# EAGLE design buttons+tft (EAGLE 9.3.1)
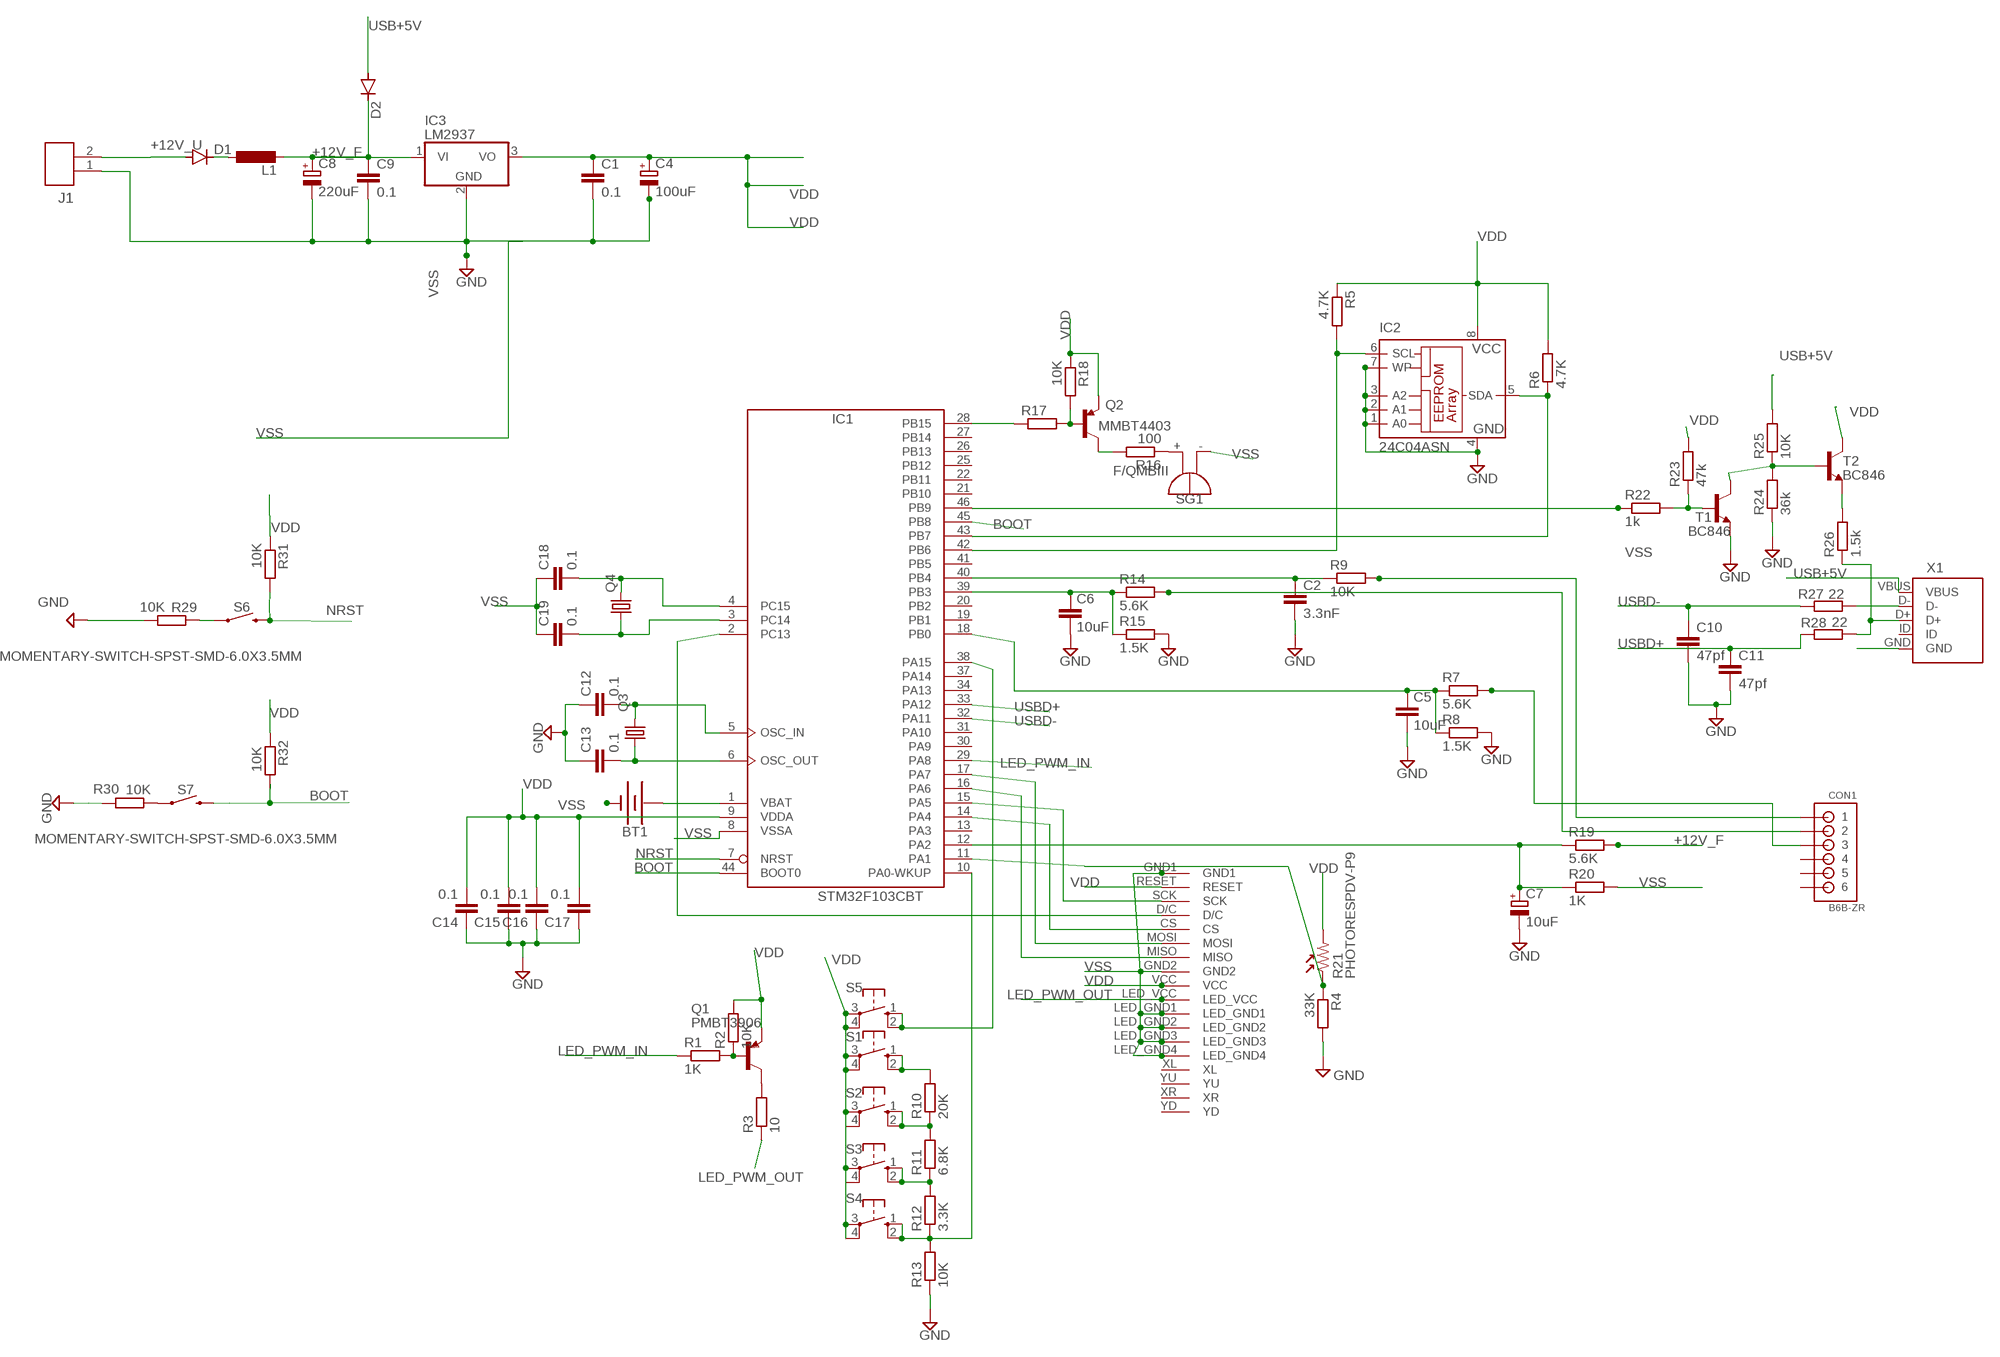
[diagram p0: schematic, sheet 1]

## Parts
BT1  BATTERY  [BATTCOM_20MM_VERTICAL]
C1  0.1  C-EUC0805  [C0805]
C2  3.3nF  C-EUC0805  [C0805]
C4  100uF  CPOL-EUSMCB  [SMC_B]
C5  10uF  C-EUC0805  [C0805]
C6  10uF  C-EUC0805  [C0805]
C7  10uF  CPOL-EUSMCA  [SMC_A]
C8  220uF  CPOL-EUSMCB  [SMC_B]
C9  0.1  C-EUC0805  [C0805]
C10  47pf  C-EUC0805  [C0805]
C11  47pf  C-EUC0805  [C0805]
C12  0.1  C-EUC0805  [C0805]
C13  0.1  C-EUC0805  [C0805]
C14  0.1  C-EUC0805  [C0805]
C15  0.1  C-EUC0805  [C0805]
C16  0.1  C-EUC0805  [C0805]
C17  0.1  C-EUC0805  [C0805]
C18  0.1  C-EUC0805  [C0805]
C19  0.1  C-EUC0805  [C0805]
CON1  B6B-ZR  [B6B-ZR]
D1  DIODE-SOD123  [SOD123]
D2  DIODE-SOD123  [SOD123]
IC1  STM32F103CBT  [LQFP48]
IC2  24C04ASN  [SO-08]
IC3  LM2937  [TO263-3]
J1  JST_ZH_2PIN  [JST_ZH_2PIN]
L1  L_EU-CDRH4D28  [INDUCTOR_CDRH4]
Q1  PMBT3906  MMBT4403LT1SMD  [SOT23-BEC]
Q2  MMBT4403  TRANSISTOR_PNPMMBT4403  [SOT23-3]
Q3  KX-9B  [5.0X3.2_2]
Q4  CRYSTALTC26H  [TC26H]
R1  1K  R-EU_R0805  [R0805]
R2  10K  R-EU_R0805  [R0805]
R3  10  R-EU_R0805  [R0805]
R4  33K  R-EU_R0805  [R0805]
R5  4.7K  R-EU_R0805  [R0805]
R6  4.7K  R-EU_R0805  [R0805]
R7  5.6K  R-EU_R0805  [R0805]
R8  1.5K  R-EU_R0805  [R0805]
R9  10K  R-EU_R0805  [R0805]
R10  20K  R-EU_R0805  [R0805]
R11  6.8K  R-EU_R0805  [R0805]
R12  3.3K  R-EU_R0805  [R0805]
R13  10K  R-EU_R0805  [R0805]
R14  5.6K  R-EU_R0805  [R0805]
R15  1.5K  R-EU_R0805  [R0805]
R16  100  R-EU_R0805  [R0805]
R17  1K  R-EU_R0805  [R0805]
R18  10K  R-EU_R0805  [R0805]
R19  5.6K  R-EU_R0805  [R0805]
R20  1K  R-EU_R0805  [R0805]
R21  PHOTORESPDV-P9  [PDV-P9XXX]
R22  1k  R-EU_R0805  [R0805]
R23  47k  R-EU_R0805  [R0805]
R24  36k  R-EU_R0805  [R0805]
R25  10K  R-EU_R0805  [R0805]
R26  1.5k  R-EU_R0805  [R0805]
R27  22  R-EU_R0805  [R0805]
R28  22  R-EU_R0805  [R0805]
R29  10K  R-EU_R0805  [R0805]
R30  10K  R-EU_R0805  [R0805]
R31  10K  R-EU_R0805  [R0805]
R32  10K  R-EU_R0805  [R0805]
S1  10-XX  [B3F-10XX]
S2  10-XX  [B3F-10XX]
S3  10-XX  [B3F-10XX]
S4  10-XX  [B3F-10XX]
S5  10-XX  [B3F-10XX]
S6  MOMENTARY-SWITCH-SPST-SMD-6.0X3.5MM  [TACTILE_SWITCH_SMD_6.0X3.5MM]
S7  MOMENTARY-SWITCH-SPST-SMD-6.0X3.5MM  [TACTILE_SWITCH_SMD_6.0X3.5MM]
SG1  F/QMBIII  [F/QMBIII]
T1  BC846  [SOT23]
T2  BC846  [SOT23]
U$1  TJC-024-9341  [TJC-024-9341]
X1  USB-MINI-TH-VERTICAL  [USB-MINI_TH-VERTICAL]

## Nets
+12V_F: C8.+ C9.1 D2.C IC3.1(VI) L1.2 R19.2
+12V_U: D1.A J1.2
BOOT: IC1.44(BOOT0) IC1.45(PB8) R32.2 S7.2
BUT1: R10.2 S1.1(S) S1.2(S1)
BUT2: R10.1 R11.2 S2.1(S) S2.2(S1)
BUT3: R11.1 R12.2 S3.1(S) S3.2(S1)
BUT_PIN: IC1.10(PA0-WKUP) R12.1 R13.2 S4.1(S) S4.2(S1)
FUEL_PIN: CON1.3 R7.2
FUEL_PIN1: C5.1 IC1.18(PB0) R7.1 R8.1
LED: Q1.C R3.2
LED_PWM_IN: IC1.29(PA8) R1.1
LED_PWM_OUT: R3.1 U$1.LED_VCC
N$1: IC1.38(PA15) S5.1(S) S5.2(S1)
N$2: IC1.42(PB6) IC2.6(SCL) R5.2
N$3: Q1.B R1.2 R2.1
N$4: IC1.17(PA7) U$1.MOSI
N$5: IC1.16(PA6) U$1.MISO
N$6: IC1.15(PA5) U$1.SCK
N$7: IC1.43(PB7) IC2.5(SDA) R6.1
N$8: IC1.14(PA4) U$1.CS
N$9: IC1.2(PC13) U$1.D/C
N$10: D1.C L1.1
N$11: C12.2 IC1.5(OSC_IN) Q3.2
N$12: R24.2 R25.1 T1.3(C) T2.1(B)
N$13: IC1.28(PB15) R17.1
N$14: R22.2 R23.1 T1.1(B)
N$15: Q2.1(B) R17.2 R18.2
N$16: Q2.3(C) R16.2
N$17: R16.1 SG1.+(-)
N$18: C13.2 IC1.6(OSC_OUT) Q3.1
N$21: R26.2 T2.2(E)
N$22: R29.1 S6.1
N$23: C7.+ IC1.12(PA2) R19.1 R20.1
N$25: R26.1 R28.1 X1.D+
N$26: R27.1 X1.D-
N$27: C18.2 IC1.4(PC15) Q4.2
N$28: C19.2 IC1.3(PC14) Q4.1
N$30: R30.1 S7.1
N$37: IC1.46(PB9) R22.1
NRST: IC1.7(NRST) R31.2 S6.2
PHOTORE_PIN: IC1.11(PA1) R4.1 R21.1
TT_PIN1: CON1.2 R14.2
TT_PIN_2: C6.1 IC1.39(PB3) R14.1 R15.1
USB+5V: D2.A R25.2 X1.VBUS
USBD+: C11.1 IC1.33(PA12) R28.2
USBD-: C10.1 IC1.32(PA11) R27.2
VBAT1: BT1.1(+) BT1.2(+) IC1.1(VBAT)
VDD: C1.1 C4.+ C14.2 C15.2 C16.2 C17.2 IC1.9(VDDA) IC2.8(VCC) IC3.3(VO) Q1.E Q2.2(E) R2.2 R5.1 R6.2 R18.1 R21.2 R23.2 R31.1 R32.1 S1.3(P) S1.4(P1) S2.3(P) S2.4(P1) S3.3(P) S3.4(P1) S4.3(P) S4.4(P1) S5.3(P) S5.4(P1) T2.3(C) U$1.RESET U$1.VCC
VF_PIN: C2.1 IC1.40(PB4) R9.1
VF_PIN1: CON1.1 R9.2
VSS: BT1.3(-) C1.2 C2.2 C4.- C5.2 C6.2 C7.- C8.- C9.2 C10.2 C11.2 C12.1 C13.1 C14.1 C15.1 C16.1 C17.1 C18.1 C19.1 IC1.8(VSSA) IC2.1(A0) IC2.2(A1) IC2.3(A2) IC2.4(GND) IC2.7(WP) IC3.2(GND) J1.1 R4.2 R8.2 R13.1 R15.2 R20.2 R24.1 R29.2 R30.2 SG1.-(+) T1.2(E) U$1.GND1 U$1.GND2 U$1.LED_GND1 U$1.LED_GND2 U$1.LED_GND3 U$1.LED_GND4 X1.GND ; supply symbol labelled GND
Unconnected: CON1.4 CON1.5 CON1.6 IC1.13(PA3) IC1.19(PB1) IC1.20(PB2) IC1.21(PB10) IC1.22(PB11) IC1.25(PB12) IC1.26(PB13) IC1.27(PB14) IC1.30(PA9) IC1.31(PA10) IC1.34(PA13) IC1.37(PA14) IC1.41(PB5) U$1.XL U$1.XR U$1.YD U$1.YU X1.ID

## Power pins joined to a net without a drawn wire
VDD: IC1.24(VDD) IC1.36(VDD) IC1.48(VDD)
VSS: IC1.23(VSS) IC1.35(VSS) IC1.47(VSS)

## Library data of the parts
BT1 = SparkFun-Batteries:BATTERY: Battery - Single Cell A variety of battery chemistries, sizes, and footprints. Device List: 20MM_PTH - Coin Cell Battery Holder - 20mm (PTH) <https://www.sparkfun.com/products/783> 6.8MM_PTH - Coin Cell Battery Holder - 6.8MM(SMD) <https://www.digikey.com/product-detail/en/seiko-instruments/MS621FE-FL11E/728-1057-ND/1889208?WT.srch=1&gclid=CNOQ5a6LzdQCFZS2wAodXCkE0g> 12MM_SMD - Coin Cell Battery Holder - 12mm (SMD) <https://www.sparkfun.com/products/10592> 12MM_PTH - Coin Cell Battery Holder - 12mm (PTH) <https://www.sparkfun.com/products/7948> 20MM_SMD - 20mm Coin Cell Battery Holder (SMD) (2 legs) Used on the Big Time Watch Kit <https://www.sparkfun.com/products/11734> 20MM_SMD_4LEGS - Coin Cell Battery Holder - 20mm (SMD) <https://www.sparkfun.com/products/11892> 20MM_SMD_4LEGS_OVERPASTE - Coin Cell Battery Holder - 20mm (SMD) <https://www.sparkfun.com/products/11892> (Over-paste on the legs) 24.5MM_PTH - Coin Cell Battery Holder - 24.5mm (PTH) <https://www.sparkfun.com/products/8863> 9V - 9V Battery Holder - PC Mount Used on the SparkFun SparkPunk Sound Kit <https://www.sparkfun.com/products/11177> and SparkFun SparkPunk Sequencer Kit <https://www.sparkfun.com/products/12707> 18650 - Battery Holder - 18650 (PTH) <https://www.sparkfun.com/products/13113> AA - Battery Holder - 1xAA (PTH) <https://www.sparkfun.com/products/7949> AAA - Battery Holder - 1xAAA (PTH) <https://www.sparkfun.com/products/12718> AA_KIT - Battery Holder - 1xAA (PTH) <https://www.sparkfun.com/products/7949> Special kit package - pads only have exposed copper on one side of the board. AAA_KIT - Battery Holder - 1xAAA (PTH) <https://www.sparkfun.com/products/12718> Special kit package - pads only have exposed copper on one side of the board.
C1 C2 C5 C6 C9-C19 = rcl:C-EU: CAPACITOR, European symbol; SPICEPREFIX: C
C4 C8 = rcl:CPOL-EU: POLARIZED CAPACITOR, European symbol; SPICEPREFIX: C
C7 = resistor:CPOL-EU: POLARIZED CAPACITOR, European symbol
CON1 = jst:B6B-ZR: JST-ZH Connector 6 pol, 1.5mm pitch Package: B6B-ZR Source: http://www.jst-mfg.com/product/pdf/eng/eZH.pdf
D1 D2 = diode:DIODE-: DIODE
IC1 = micro-stm_v3:STM32F103C*T: ARM 32-bit Cortex™-M3 CPU 72 MHz maximum frequency 16 to 128 Kbytes of Flash memory 6 to 20 kbytes of SRAM 37 GPIOs 2.0 to 3.6 V application supply
IC2 = microchip:24C*: Serial EEPROM 1 K/2 K/4 K; OC_FARNELL: unknown; OC_NEWARK: unknown
IC3 = linear:LM2937: LM2937-2.5, LM2937-3.3 400mA and 500mA Voltage Regulators Source: http://cache.national.com/ds/LM/LM2937-2.5.pdf
J1 = kanflo:JST_ZH_2PIN: JST ZH connector, 2 pins ZH has 1.5mm spacing. Datasheet <http://www.jst-mfg.com/product/pdf/eng/eZH.pdf>
L1 = m-pad-2.1:L_EU: Inductors in various packages from: - Sumida - Panasonic - Coilcraft
Q1 = transistor-pnp:MMBT4403*: PNP Transistror
Q2 = User-Submitted:TRANSISTOR_PNP: Generic PNP BJT Double check pinouts against datasheets- not all devices are the same! MMBT3906 - 40V 200mA SOT-23 (TRANS-08052) MMBT4403 - 40V 600mA SOT-23 (TRANS-09245); PROD_ID: TRANS-09245
Q3 = crystal-geyer_V1_0:KX: Quartz Crystals (MHz) SMD: KX - Serie Model Size l/w/h [mm] Frequency Range Frequency Stability Temp. Range [°C] Load Capacitance AECQ 200 availabel Datasheet KX-4 KX-5 KX-6 KX-7 KX-9A KX-9B KX-12A KX-12B KX-13 KX-20 KX-K KX-KS 1.6/1.2/0.3 2.0/1.6/0.45 2.5/2.0/0.55 3.2/2.5/0.8 5.0/3.2/1.0 5.0/3.2/1.1 6.0/3.5/1.1 6.0/3.5/1.0 7.0/5.0 /1.3 11.6/5.5/1.6 12.3/4.5/4.2 12.3/4.5/3.2 24.0 ~ 80.0 MHz 16.0 ~ 80.0 MHz 12.0 ~ 80.0 MHz 8.0 ~ 60.0 MHz 7,68 ~ 300,0 MHz 8,0 ~ 50,0 MHz 8,0 ~ 150,0 MHz 8,0 ~ 50,0 MHz 6,0 ~ 160,0 MHz 3,579 ~ 25,0 MHz 3,579 ~ 70,0 MHz 3,579 ~ 70,0 MHz ±10 … ±50ppm ±10 … ±50ppm ±10 … ±50ppm ±10 … ±50ppm ±10 … ±50ppm ±10 … ±50ppm ±10 … ±50ppm ±10 … ±50ppm ±10 … ±50ppm ±50ppm ±10 … ±50ppm ±10 … ±50ppm (*) -40°C …+85°C (*) -40°C …+125°C (*) -40°C …+125°C (*) -40°C …+125°C (*) -40°C …+105°C (*) -40°C …+105°C (*) -40°C …+125°C (*) -40°C …+105°C (*) -40°C …+105°C (*) -40°C …+105°C (*) -40°C …+85°C (*) -40°C …+85°C 8, 8…16 8, 8…16 10, 8…16 12, 7…20 16, 10…20 16, 10…20 16, 10…20 16, 12…20 16, 12…20 16, 12…20 16, 12…30 16, 12…30 - yes yes yes - - - - - - - - KX-4.pdf <http://www.geyer-electronic.de/uploads/tx_userartikelfrequenz/GEYER-KX-4.pdf> KX-5.pdf <http://www.geyer-electronic.de/uploads/tx_userartikelfrequenz/GEYER-KX-5.pdf> KX-6.pdf <http://www.geyer-electronic.de/uploads/tx_userartikelfrequenz/GEYER-KX-6.pdf> KX-7.pdf <http://www.geyer-electronic.de/uploads/tx_userartikelfrequenz/GEYER-KX-7.pdf> KX-9A.pdf <http://www.geyer-electronic.de/uploads/tx_userartikelfrequenz/GEYER-KX-9A.pdf> KX-9B.pdf <http://www.geyer-electronic.de/uploads/tx_userartikelfrequenz/GEYER-KX-9B.pdf> KX-12A.pdf <http://www.geyer-electronic.de/uploads/tx_userartikelfrequenz/GEYER-KX-12A.pdf> KX-12B.pdf <http://www.geyer-electronic.de/uploads/tx_userartikelfrequenz/GEYER-KX-12B.pdf> KX-13.pdf <http://www.geyer-electronic.de/uploads/tx_userartikelfrequenz/GEYER-KX-13.pdf> KX-20.pdf <http://www.geyer-electronic.de/uploads/tx_userartikelfrequenz/GEYER-KX-20.pdf> KX-K.pdf <http://www.geyer-electronic.de/uploads/tx_userartikelfrequenz/GEYER-KX-K.pdf> KX-KS.pdf <http://www.geyer-electronic.de/uploads/tx_userartikelfrequenz/GEYER-KX-KS.pdf> <http://www.geyer-electronic.de/fileadmin/template/img/logo-geyer-electronic.png> Details see: http://www.geyer-electronic.de/Frequenz-Produkte.9.0.html Created 2016-06-07, Hans Locher 2016 (C) Geyer Quartz Technology KX4,KX5,KX6,KX7,KX9A,KX9B,KX12A,KX12B,KX13,KX20,KXK,KXKS;1612;2016;2520;3225;5032;6035;7050;11655;12345;1,6x1,2;2,0x1,6;2,5x2,0;3,2x2,5;5,0x3,2;6,0x3,5;7,0x5,0;11,6x5,5;12,3x4,5;12,3x4,5;1.6x1.2;2.0x1.6;2.5x2.0;3.2x2.5;5.0x3.2;6.0x3.5;7.0x5.0;11.6x5.5;12.3x4.5;12.3x4.5;
Q4 = crystal:CRYSTAL: CRYSTAL; OC_FARNELL: unknown; OC_NEWARK: unknown
R1-R20 R22-R32 = resistor:R-EU_: RESISTOR, European symbol
R21 = my_mixed:PHOTORES: Photoresistor
S1-S5 = switch-omron:10-XX: OMRON SWITCH; MPN: B3F-1000; OC_FARNELL: 176432; OC_NEWARK: 36M3542
S6 S7 = SparkFun-Switches:MOMENTARY-SWITCH-SPST: Momentary Switch (Pushbutton) - SPST Normally-open (NO) SPST momentary switches (buttons, pushbuttons). Variants PTH-12MM - 12mm square, through-hole Momentary Pushbutton Switch - 12mm Square <https://www.sparkfun.com/products/9190> (COM-09190) PTH-6.0MM, PTH-6.0MM-KIT - 6.0mm square, through-hole Mini Pushbutton Switch <https://www.sparkfun.com/products/97> (COM-00097) KIT package intended for soldering kit's - only one side of pads' copper is exposed. PTH-RIGHT-ANGLE-KIT - Right-angle, through-hole Right Angle Tactile Button <https://www.sparkfun.com/products/10791> - Used on SparkFun BigTime Watch Kit <https://www.sparkfun.com/products/11734> SMD-12MM - 12mm square, surface-mount Tactile Button - SMD (12mm) <https://www.sparkfun.com/products/12993> (COM-12993) Used on SparkFun PicoBoard <https://www.sparkfun.com/products/11888> SMD-4.5MM - 4.5mm Square Trackball Switch Used on SparkFun Blackberry Trackballer Breakout <https://www.sparkfun.com/products/13169> SMD-4.6MMX2.8MM - 4.60mm x 2.80mm, surface mount Used on SparkFun SAMD21 Mini Breakout <https://www.sparkfun.com/products/13664> SMD-5.2MM, SMD-5.2-REDUNDANT - 5.2mm square, surface-mount Mini Pushbutton Switch - SMD <https://www.sparkfun.com/products/8720> (COM-08720) Used on Arduino Pro Mini <https://www.sparkfun.com/products/11114> REDUNDANT package connects both switch circuits together SMD-6.0X3.5MM - 6.0 x 3.5mm, surface mount Momentary Reset Switch SMD <https://www.sparkfun.com/products/8229> (COM-08229) SMD-6.2MM-TALL - 6.2mm square, surface mount Tactile Button - SMD (6mm) <https://www.sparkfun.com/products/12992> Used on SparkFun Digital Sandbox <https://www.sparkfun.com/products/12651> SMD-RIGHT-ANGLE - Right-angle, surface mount Used on SparkFun Block for Intel® Edison - Arduino <https://www.sparkfun.com/products/13036>; PROD_ID: SWCH-00815; SF_SKU: COM-08229
SG1 = buzzer:F/QMBIII: BUZZER Source: Buerklin; OC_FARNELL: unknown; OC_NEWARK: unknown
T1 T2 = transistor-neu-to92:BC846: NPN TRANSISTOR
U$1 = diy-modules:TJC-024-9341
X1 = kanflo:USB-MINI-TH-VERTICAL: Vertical USB mini through hole connector A low cost vertical USB mini connector from eBay, found here <http://www.ebay.com/itm/181392933768>.

## Board
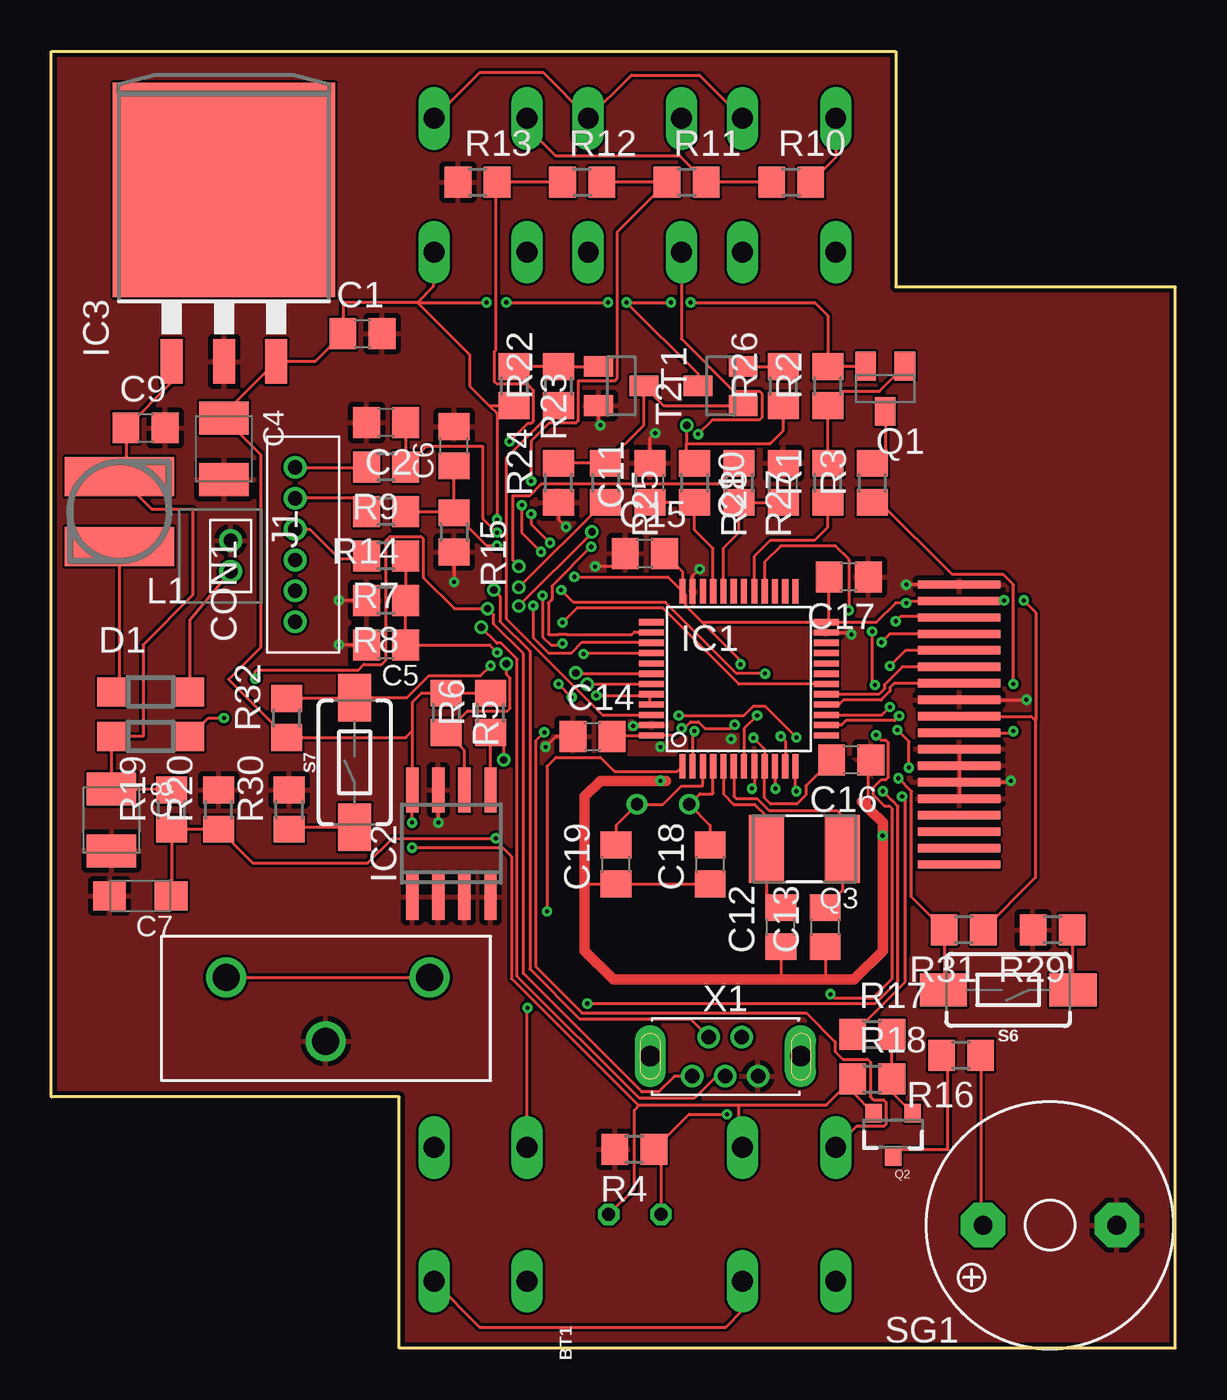
[diagram p1: board, top side]
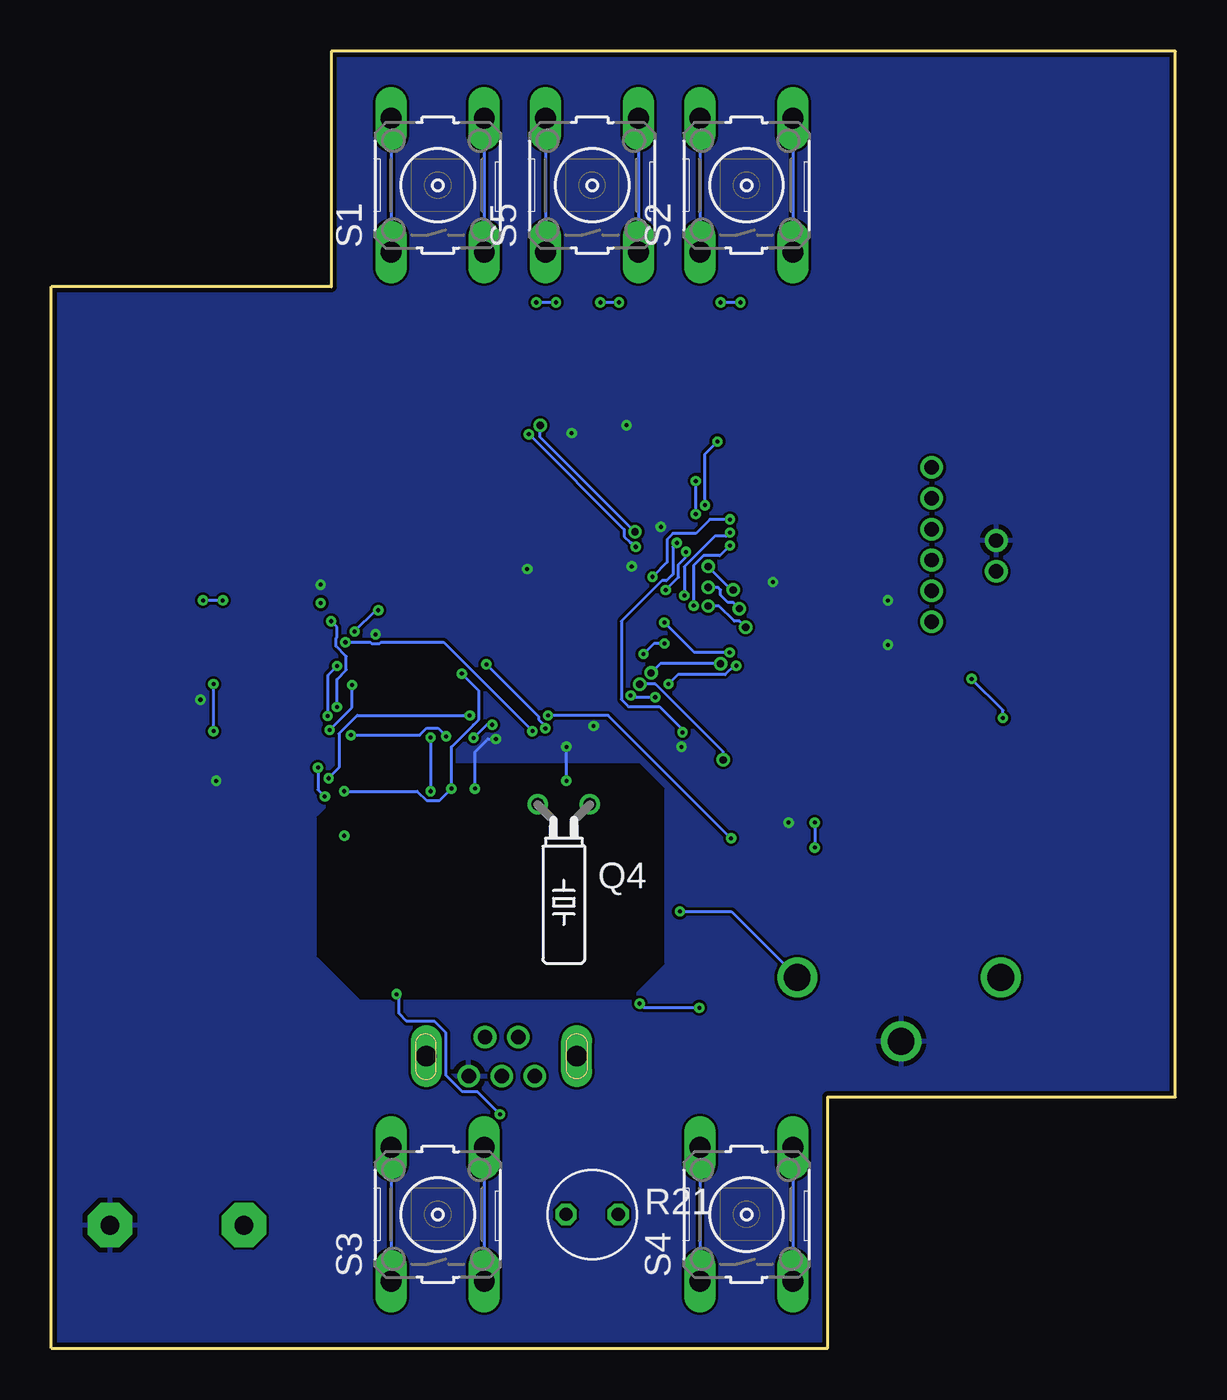
[diagram p2: board, bottom side, seen from below]

Size 54.61 x 62.99 mm. Coordinates in mm from the lower left corner, seen from the top.
Outline: 0,62.99 41.02,62.99 41.02,51.56 54.61,51.56 54.61,0 16.89,0 16.89,12.19 0,12.19 0,62.99
Copper layers (1*16): Top 0.035mm / dielectric 1.5mm / Bottom 0.035mm
Design rules "jlcpcb": minimum track width 5mil, minimum drill 0.2mm, track to track 5mil, track to pad 5mil, pad to pad 5mil, via to via 5mil, smd to smd 5mil, copper to edge 0.2mm, drill to drill 6mil, minimum pad ring 0.2mm, minimum via ring 0.15mm, stop-mask expansion 4mil, vias tented up to drill 0mil, thermal gap 10mil

### Footprints (pad centres in the part's own frame; a part is rotated, then mirrored left to right if it is on the bottom)
BATTCOM_20MM_VERTICAL = drill 1.3: 1 4.85,-2; 2 -5.04,-2; 3 0.01,1.1
C0805 = smd 1.3 x 1.5: 1 -0.95,0; 2 0.95,0
SMC_B = smd 1.6 x 2.4: + -1.5,0; - 1.5,0
SMC_A = smd 1.6 x 1.4: + -1.5,0; - 1.5,0
B6B-ZR = drill 0.7: 1 9,-1.3; 2 7.5,-1.3; 3 6,-1.3; 4 4.5,-1.3; 5 3,-1.3; 6 1.5,-1.3
SOD123 = smd 1.4 x 1.4: A 1.9,0; C -1.9,0
LQFP48 = smd 0.3 x 1.2: 1 -2.75,-4.25; 2 -2.25,-4.25; 3 -1.75,-4.25; 4 -1.25,-4.25; 5 -0.75,-4.25; 6 -0.25,-4.25; 7 0.25,-4.25; 8 0.75,-4.25; 9 1.25,-4.25; 10 1.75,-4.25; 11 2.25,-4.25; 12 2.75,-4.25; 25 2.75,4.25; 26 2.25,4.25; 27 1.75,4.25; 28 1.25,4.25; 29 0.75,4.25; 30 0.25,4.25; 31 -0.25,4.25; 32 -0.75,4.25; 33 -1.25,4.25; 34 -1.75,4.25; 35 -2.25,4.25; 36 -2.75,4.25 | smd 1.2 x 0.3: 13 4.25,-2.75; 14 4.25,-2.25; 15 4.25,-1.75; 16 4.25,-1.25; 17 4.25,-0.75; 18 4.25,-0.25; 19 4.25,0.25; 20 4.25,0.75; 21 4.25,1.25; 22 4.25,1.75; 23 4.25,2.25; 24 4.25,2.75; 37 -4.25,2.75; 38 -4.25,2.25; 39 -4.25,1.75; 40 -4.25,1.25; 41 -4.25,0.75; 42 -4.25,0.25; 43 -4.25,-0.25; 44 -4.25,-0.75; 45 -4.25,-1.25; 46 -4.25,-1.75; 47 -4.25,-2.25; 48 -4.25,-2.75
SO-08 = smd 0.6 x 2.2: 1 -1.905,-2.6; 2 -0.635,-2.6; 3 0.635,-2.6; 4 1.905,-2.6; 5 1.905,2.6; 6 0.635,2.6; 7 -0.635,2.6; 8 -1.905,2.6
TO263-3 = smd 1.067 x 2.159: 1 -2.54,-5.791; 2 0,-5.791; 3 2.54,-5.791 | smd 10.8 x 10.41: TAB 0,2.54
JST_ZH_2PIN = drill 0.7 pad 1: 1 -0.75,0.45; 2 0.75,0.45
INDUCTOR_CDRH4 = smd 5.3 x 1.9: 1 0,1.7; 2 0,-1.7
SOT23-BEC = smd 1 x 1.4: B -0.95,-1.1; C 0,1.1; E 0.95,-1.1
SOT23-3 = smd 0.8 x 0.9: 1 -0.95,-1; 2 0.95,-1; 3 0,1.1
5.0X3.2_2 = smd 1.7 x 3.3: 1 -1.85,0; 2 1.85,0
TC26H = drill 0.6: 1 -1.27,0; 2 1.27,0
R0805 = smd 1.3 x 1.5: 1 -0.95,0; 2 0.95,0
PDV-P9XXX = drill 0.635 octagon: 1 -1.27,0; 2 1.27,0
B3F-10XX = drill 1.016 long: 1 -3.251,2.261; 2 3.251,2.261; 3 -3.251,-2.261; 4 3.251,-2.261
TACTILE_SWITCH_SMD_6.0X3.5MM = smd 2.3 x 1.6: 1 -3.15,0; 2 3.15,0
F/QMBIII = drill 0.914 pad 2.159 octagon: + 3.251,0; - -3.251,0
SOT23 = smd 1 x 1.4: 1 -0.95,-1.1; 2 0.95,-1.1; 3 0,1.1
TJC-024-9341 = smd 4 x 0.406: CS 0.8,3.2; D/C 0.8,4; GND1 0.8,6.4; GND2 0.8,0.8; LED_GND1 0.8,-1.6; LED_GND2 0.8,-2.4; LED_GND3 0.8,-3.2; LED_GND4 0.8,-4; LED_VCC 0.8,-0.8; MISO 0.8,1.6; MOSI 0.8,2.4; RESET 0.8,5.6; SCK 0.8,4.8; VCC 0.8,0; XL 0.8,-4.8; XR 0.8,-6.4; YD 0.8,-7.2; YU 0.8,-5.6
USB-MINI_TH-VERTICAL = drill 0.7: D+ -0.16,-1.27; D- -0.96,0.63; GND 1.44,-1.27; ID 0.65,0.63; VBUS -1.76,-1.27 | drill 1 pad 1.5 long: P$1 -3.8,-0.3; P$2 3.5,-0.3

### Placement (x,y rotation side)
BT1  13.34,16 180 top
C1  15.11,49.28 0 top
C2  16.26,44.96 180 top
C4  8.38,43.69 270 top
C5  16.26,34.16 180 top
C6  19.56,43.81 90 top
C7  4.32,21.97 180 top
C8  2.92,25.65 270 top
C9  4.57,44.7 0 top
C10  35.56,42.04 90 top
C11  29.08,42.04 90 top
C12  35.43,20.45 90 top
C13  37.59,20.45 90 top
C14  26.29,29.72 0 top
C15  28.83,38.61 0 top
C16  38.86,28.57 180 top
C17  38.73,37.46 180 top
C18  32,23.5 90 top
C19  27.43,23.5 90 top
CON1  10.54,33.78 90 top
D1  4.83,31.88 0 top
D2  4.83,29.72 0 top
IC1  33.4,32.51 0 top
IC2  19.43,24.51 0 top
IC3  8.38,53.72 0 top
J1  8.25,38.48 270 top
L1  3.3,40.64 180 top
Q1  40.51,46.61 180 top
Q2  40.89,10.41 180 top
Q3  36.58,24.26 180 top
Q4  29.72,26.42 180 bottom
R1  37.72,42.04 90 top
R2  37.72,46.74 90 top
R3  39.88,42.04 90 top
R4  28.32,9.65 180 top
R5  19.18,30.86 270 top
R6  21.34,30.86 90 top
R7  16.26,38.48 180 top
R8  16.26,36.32 180 top
R9  16.26,42.8 180 top
R10  35.94,56.64 0 top
R11  30.86,56.64 0 top
R12  25.78,56.64 0 top
R13  20.7,56.64 0 top
R14  16.26,40.64 180 top
R15  19.56,39.62 270 top
R16  44.2,14.22 180 top
R17  39.88,15.24 0 top
R18  39.88,13.08 0 top
R19  5.84,26.16 90 top
R20  8.13,26.16 90 top
R21  28.34,6.49 0 bottom
R22  24.64,46.74 90 top
R23  22.48,46.74 270 top
R24  24.64,42.04 90 top
R25  26.92,42.04 270 top
R26  35.56,46.74 90 top
R27  33.4,42.04 270 top
R28  31.24,42.04 270 top
R29  48.64,20.32 180 top
R30  11.56,26.16 90 top
R31  44.32,20.32 180 top
R32  11.43,30.61 90 top
S1  35.84,56.49 90 bottom
S2  20.84,56.49 90 bottom
S3  35.84,6.49 90 bottom
S4  20.84,6.49 90 bottom
S5  28.34,56.49 90 bottom
S6  46.48,17.4 180 top
S7  14.73,28.45 90 top
SG1  48.51,5.97 180 top
T1  27.69,46.74 270 top
T2  32.51,46.74 90 top
U$1  43.3,30.69 0 top
X1  32.89,14.48 0 top

### Tracks (layer width: path | path; a pad name or v marks a point on that pad's centre or on a via)
+12V_F
  Top 0.152: R19.2 5.8,27.15 C8.+ D2.C 4.45,29.72 4.45,34.16 6.86,36.58 6.86,40.77 4.88,40.77 L1.2 3.62,42.34 C9.1 5.84,46.92 IC3.1
+12V_U
  Top 0.152: J1.2 6.73,35.35 D1.A
BOOT  (via drill 0.2)
  Top 0.152: R32.2 14.69,31.56 S7.2 17.28,31.6 18.34,32.66 20.85,32.66 v21.34,33.15 | v24.63,32.26 v25.27,31.62 | v26.47,31.7 29.09,31.7 | 29.09,31.7 IC1.44 | IC1.45 29.09,31.32 29.09,31.7
  Bottom 0.152: v21.34,33.15 21.46,33.15 21.88,32.72 24.17,32.72 v24.63,32.26 | v25.27,31.62 26.39,31.62 v26.47,31.7
BUT1
  Top 0.152: S1.2 38.1,57.85 R10.2
  Bottom 0.152: S1.2 S1.1 38.1,53.21 38.48,52.83
BUT2
  Top 0.152: R10.1 R11.2 30.54,57.91 24.51,57.91 23.1,59.32 S2.2
  Bottom 0.152: S2.2 S2.1
BUT3  (via drill 0.2)
  Top 0.152: R12.2 R11.1 27.49,54.22 27.49,47.1 27.37,46.98 25.59,46.98 25.59,45.05 25.47,44.93 24.18,44.93 23.31,44.06 v23.31,42.12 | v23.31,40.51 23.31,40.04 v24.23,39.12 | v23.95,29.91 23.52,29.48 23.52,18.53 25.77,16.28 36.68,16.28 38.08,14.88 38.08,14.41 38.45,14.03 39.66,14.03 39.78,13.91 39.78,12.23 39.94,12.07 40.43,12.07 40.55,11.95 40.55,10.88 40.43,10.76 39.12,10.76 S3.2
  Bottom 0.152: S3.2 S3.1 | v23.31,42.12 v23.31,40.51 | 24.45,37.53 24.42,37.57 24.42,37.59 | 24.42,37.59 24.42,38.93 v24.23,39.12 | 24.42,37.59 24.73,37.28 24.95,37.28 26.92,35.31 26.92,31.51 26.58,31.16 25.07,31.16 23.89,29.98 v23.95,29.91
BUT_PIN  (via drill 0.2)
  Top 0.152: R12.1 R13.2 21.59,56.58 21.59,48.48 21.53,48.42 21.53,46.95 21.64,46.83 23.12,46.83 23.43,46.52 23.43,45.05 23.31,44.93 23.14,44.93 v22.25,44.04 | IC1.10 35.15,27.21 v35.18,27.18 | v34.67,32.76 33.29,32.76 29.83,36.22 25.37,36.22 v24.77,36.83 | v23.78,38.68 22.86,39.6 v22.86,40.95 | S4.2 23.1,16.5 v23.13,16.53 | v26.04,16.73 40.03,16.73 41.13,17.84 41.13,26.31 40.85,26.6 40.83,26.6 40.57,26.86 40.57,26.88 v40.39,27.05
  Bottom 0.152: S4.2 S4.1 | v34.67,32.76 33.84,31.93 33.84,30.55 34.1,30.28 34.11,30.28 35.18,29.21 v35.18,27.18 35.76,26.6 36.38,26.6 36.84,27.05 v40.39,27.05 | v24.77,36.83 24.14,37.45 24.14,38.08 23.78,38.43 v23.78,38.68 | v22.86,40.95 22.86,43.44 v22.25,44.04 | v23.13,16.53 25.83,16.53 v26.04,16.73
CUT_TOP
  cutout Top: 32.89,28.7 38.73,28.7 41.66,25.78 41.66,19.05 39.62,17.02 26.54,17.02 24.89,18.67 24.89,27.18 26.42,28.7 32.64,28.7 32.89,28.32
CUT_TOP1
  cutout Bottom: 26.04,28.32 39.12,28.32 41.66,25.78 41.66,19.05 39.62,17.02 26.54,17.02 24.89,18.67 24.89,27.18
FUEL_PIN
  Top 0.152: CON1.3 12.54,39.78 13.97,38.35 15.18,38.35 R7.2
FUEL_PIN1  (via drill 0.2)
  Top 0.152: R7.1 R8.1 C5.1 21.29,34.16 v21.66,33.79 | v24.83,35.24 25.53,35.94 29.72,35.94 33.4,32.26 IC1.18
  Bottom 0.152: v21.66,33.79 23.38,33.79 v24.83,35.24
LED
  Top 0.152: Q1.C 40.51,43.62 R3.2
LED_PWM_IN
  Top 0.152: IC1.29 34.15,38.47 34.93,39.24 37.08,39.24 37.72,39.88 R1.1
LED_PWM_OUT  (via drill 0.2)
  Top 0.152: R3.1 40.26,41.09 43.75,37.59 46.23,37.59 46.74,37.08 v46.74,32.26 | U$1.LED_VCC 46.66,29.89 v46.74,29.97
  Bottom 0.152: v46.74,29.97 v46.74,32.26
N$1  (via drill 0.2)
  Top 0.152: S5.1 30.6,49.03 33.15,46.49 34.4,46.49 34.52,46.37 34.52,45.2 34.4,45.08 32.11,45.08 v31.42,44.39 | v26.22,38.93 24.31,37.02 24.31,36.38 24.15,36.21 24.15,34.67 24.63,34.67 24.64,34.68 25.01,34.68 25.03,34.67 28.19,34.67 28.32,34.8 29.12,34.8 IC1.38
  Bottom 0.152: S5.2 S5.1 | v31.42,44.39 26.79,39.77 26.79,39.43 26.48,39.12 26.42,39.12 v26.22,38.93
N$2  (via drill 0.35)
  Top 0.152: IC2.6 20.07,29.02 R5.2 20.22,30.96 22.17,30.96 22.29,31.08 22.29,32.54 22.1,32.73 v22.1,33.25 | v25.48,32.8 25.52,32.76 25.79,32.76 25.81,32.78 26.25,32.78 26.26,32.76 IC1.42
  Bottom 0.152: v22.1,33.25 25.03,33.25 v25.48,32.8
N$3
  Top 0.152: R1.2 R2.1 38.41,46.48 40.24,46.48 Q1.B
N$4
  Top 0.152: IC1.17 40.19,31.76 40.46,32.03 40.46,32.21 41.34,33.09 U$1.MOSI
N$5
  Top 0.152: U$1.MISO 40.93,32.29 40.74,32.1 40.74,31.91 40.31,31.48 38.48,31.48 38.26,31.26 IC1.16
N$6  (via drill 0.2)
  Top 0.152: 43.89,35.38 44.07,35.46 U$1.SCK 44.03,35.56 41.27,35.56 v41.02,35.31 | IC1.15 40.36,30.76 v40.74,31.14
  Bottom 0.152: v41.02,35.31 40.74,35.02 40.74,34.52 40.78,34.48 40.78,34.1 40.28,33.6 40.28,32.95 40.74,32.49 v40.74,31.14
N$7  (via drill 0.35)
  Top 0.152: IC2.5 R6.1 21.97,29.28 v21.97,28.57 | v26.03,32.25 29.14,32.25 IC1.43
  Bottom 0.152: v21.97,28.57 21.97,28.96 25.27,32.25 v26.03,32.25
N$8  (via drill 0.2)
  Top 0.152: IC1.14 38.39,30.26 38.61,30.48 40.97,30.48 v41.19,30.71 | U$1.CS 41.49,33.89 v40.73,33.13
  Bottom 0.152: v40.73,33.13 41.19,32.68 v41.19,30.71
N$9  (via drill 0.2)
  Top 0.152: v31.24,29.97 31.15,29.88 IC1.2 | v40.33,34.29 40.73,34.69 U$1.D/C
  Bottom 0.152: v40.33,34.29 39.12,34.29 39.05,34.22 38.67,34.22 38.6,34.29 35.56,34.29 v31.24,29.97
N$10
  Top 0.152: L1.1 3.3,32.25 D1.C
N$11
  Top 0.152: IC1.5 32.65,26.91 33.15,26.42 34.16,26.42 34.73,25.85 Q3.2 34.73,22.1 C12.2
N$12
  Top 0.152: T2.1 29.74,45.79 T1.3 28.79,44.85 R25.1 R24.2
N$13  (via drill 0.2)
  Top 0.152: R17.1 41.46,17.77 41.46,26.67 v41.33,26.8 | v41.66,28.2 41.66,29.47 v41.1,30.03 | v40.01,32.21 39.88,32.34 v39.88,34.81 | v38.73,35.84 38.73,38.33 38.1,38.96 35.43,38.96 34.65,38.18 IC1.28
  Bottom 0.152: v41.33,26.8 41.66,27.12 v41.66,28.19 v41.66,28.2 | v41.1,30.03 40.01,31.12 v40.01,32.21 | v39.88,34.81 39.88,34.83 38.86,35.84 v38.73,35.84
N$14
  Top 0.152: T1.1 R22.2 R23.1
N$15
  Top 0.152: Q2.1 40.83,12.43 R18.2 R17.2
N$16
  Top 0.152: Q2.3 41.23,9.65 43.56,9.65 43.56,13.91 R16.2
N$17
  Top 0.152: R16.1 45.15,6.09 SG1.+
N$18
  Top 0.152: IC1.6 33.15,26.82 33.27,26.7 34.28,26.7 34.86,26.11 38.15,26.11 38.43,25.84 Q3.1 38.43,22.23 C13.2
N$21
  Top 0.152: T2.2 R26.2
N$22
  Top 0.152: S6.1 49.63,20.28 R29.1
N$23  (via drill 0.2)
  Top 0.152: v21.59,24.77 16.56,24.77 15.36,23.56 9.78,23.56 R20.1 R19.1 5.84,22 C7.+ | v30.48,30.73 33.65,30.73 34.1,31.19 34.67,31.19 v36.2,29.66 | v36.2,27.05 36.15,27.1 IC1.12
  Bottom 0.152: v21.59,24.77 27.56,30.73 v30.48,30.73 | v36.2,29.66 v36.2,27.05
N$25  (via drill 0.35)
  Top 0.152: R28.1 30.86,43.37 30.86,43.94 | 30.86,43.94 34.93,43.94 35.56,44.58 R26.1 | X1.D+ 32.31,13.21 31.24,12.14 28.56,12.14 22.63,18.07 22.63,33.46 21.85,34.25 21.65,34.25 v20.88,35.01 | v22.71,36.05 26.26,39.6 v26.26,39.65 | v30.86,44.83 30.86,43.94
  Bottom 0.152: v20.88,35.01 21.18,35.31 21.44,35.31 22.17,36.05 v22.71,36.05 | v26.26,39.65 30.86,44.25 v30.86,44.83
N$26  (via drill 0.35)
  Top 0.152: R27.1 32.38,41.97 23.79,41.97 23.23,41.4 22.4,41.4 22.4,38.27 v22.71,37.97 | v21.49,36.83 21.79,36.53 21.79,35.31 23.24,33.86 23.24,18.41 25.65,16 31.04,16 X1.D-
  Bottom 0.152: v22.71,37.97 21.56,36.83 v21.49,36.83
N$27
  Top 0.152: C18.2 32,25.4 Q4.2 31.5,26.92 32.13,26.92 32.15,26.94 IC1.4
N$28
  Top 0.152: C19.2 27.43,25.4 Q4.1 29.72,26.42 30.61,27.3 31.62,27.3 31.65,27.33 IC1.3
N$30
  Top 0.152: S7.1 11.64,25.3 R30.1
N$37
  Top 0.152: R22.1 22.1,43.25 22.1,35.43 26.77,30.76 IC1.46
NRST  (via drill 0.2)
  Top 0.152: v41.15,27.69 41.78,27.05 41.78,21.91 R31.2 43.37,17.44 S6.2 | v34.29,30.73 33.65,30.1 IC1.7
  Bottom 0.152: v41.15,27.69 40.64,28.19 40.64,29.85 39.75,30.73 v34.29,30.73
PHOTORE_PIN  (via drill 0.2)
  Top 0.152: R21.1 29.61,9.31 R4.1 30.98,11.36 v32.82,11.36 | v37.85,17.19 38.02,17.01 39.91,17.01 40.85,17.95 40.85,26.2 40.73,26.32 40.49,26.32 39.94,26.86 39.94,27.24 40.32,27.62 40.55,27.62 40.66,27.74 40.66,29.41 40.55,29.53 40.32,29.53 v40.07,29.78 | v35.43,29.72 35.65,29.5 IC1.11
  Bottom 0.152: v32.82,11.36 33.92,12.45 34.65,12.45 35.44,13.25 35.44,15.32 36,15.88 37.35,15.88 37.72,16.26 37.72,17.02 37.85,17.14 v37.85,17.19 | v40.07,29.78 36.72,29.78 36.38,30.12 35.83,30.12 v35.43,29.72
TT_PIN1
  Top 0.152: R14.2 14.66,41.28 CON1.2
TT_PIN_2  (via drill 0.2)
  Top 0.152: R14.1 19.49,40.64 R15.1 | R15.1 C6.1 | R15.1 21.14,38.99 v21.64,38.99 | v23.41,36.07 23.41,34.52 24.15,33.78 25.27,33.78 25.78,34.29 29.12,34.29 IC1.39
  Bottom 0.152: v21.64,38.99 22.13,38.5 22.92,38.5 23.41,38.02 v23.41,36.07
USB+5V  (via drill 0.2, 0.35)
  Top 0.152: X1.VBUS 30.27,13.21 29.5,12.44 28.69,12.44 22.94,18.19 22.94,33.73 21.49,35.18 21.49,35.62 v21.19,35.92 19.58,35.92 18.06,37.44 18.06,39.31 17.94,39.43 16.47,39.43 16.35,39.31 16.35,38.96 16.26,38.86 | v22.71,36.96 26.84,41.09 R25.2 | D2.A 7.61,30.61 v8.38,30.61 | v9.91,32.51 9.91,32.86 9.99,32.95 14.92,32.95 15.18,33.21 16.04,33.21 16.26,33.43 16.26,38.86 | 16.26,38.86 16.26,39.24
  Bottom 0.152: v22.71,36.96 22.22,36.96 22.1,36.83 22.1,36.58 21.74,36.22 21.49,36.22 v21.19,35.92 | v8.38,30.61 8.38,30.99 v9.91,32.51
USBD+
  Top 0.152: C11.1 R28.2 31.24,39.75 32.15,38.84 IC1.33
USBD-
  Top 0.152: IC1.32 32.65,38.87 33.4,39.62 R27.2 C10.1
VBAT1  (via drill 0.2)
  Top 0.152: v24.08,21.21 24.08,28.27 24.51,28.7 26.67,28.7 27.36,28.02 30.41,28.02 IC1.1 | BT1.1 BT1.2
  Bottom 0.152: v24.08,21.21 21.58,21.21 BT1.2
VDD  (via drill 0.2)
  Top 0.152: Q1.E 37.74,47.71 R2.2 37.72,50.16 37.08,50.8 v31.05,50.8 | 47.81,30.48 47.81,22.86 R31.1 | C15.2 30.65,37.74 IC1.36 | C14.2 27.28,29.76 IC1.48 30.27,29.76 v30.62,30.11 30.74,30.11 31.05,30.43 31.43,30.43 31.75,30.11 33.02,30.11 v33.2,30.28 | IC1.24 40.09,35.26 41.02,36.2 v41.53,36.2 41.53,36.29 U$1.RESET 46.25,36.29 v46.28,36.32 | IC1.24 37.79,35.4 C17.2 | S2.3 | S2.3 | 17.78,50.8 14.16,50.8 C1.1 12.82,47.93 IC3.3 8.38,45.39 C4.+ 10.16,43.41 10.16,34.04 8.61,32.48 R32.1 17.21,29.66 17.53,29.97 | S2.3 18.58,51.59 17.78,50.8 | 17.78,50.8 20.32,48.26 20.32,46.74 21.27,45.79 | 21.27,45.79 R23.2 | S2.4 20.81,61.98 23.88,61.98 26.08,59.77 S5.4 28.19,61.85 31.48,61.85 S1.4 | S4.3 20.8,1.02 32.77,1.02 33.58,1.83 S3.3 | R6.2 R5.1 17.97,31.81 17.53,31.37 17.53,29.97 | 17.53,29.97 IC2.8 v17.53,25.53 | v17.53,24.31 21.92,24.31 22.35,23.88 22.35,17.95 28.49,11.81 28.58,11.81 | 28.58,11.81 33.4,11.81 | R21.2 28.32,7.74 28.32,11.56 28.58,11.81 | S3.4 33.4,9.92 33.4,11.81 | C16.2 36.65,27.31 36.65,26.86 36.22,26.43 34.94,26.43 34.65,26.72 IC1.9 34.65,29.1 v34.1,29.64 | 21.27,45.79 21.64,45.41 v21.64,40.26 | v25.41,37.47 29.94,37.47 IC1.36 | IC1.36 30.8,36.61 30.8,36.08 31.61,35.26 | 31.61,35.26 IC1.24 | 31.61,35.26 33.48,33.4 v33.48,33.22 | 17.78,50.8 v21.14,50.8 | v22.1,50.8 v27.04,50.8 | T2.3 31.41,47.33 v27.94,50.8 v30.1,50.8 | Q2.2 38.93,12.43 R18.1 37.66,11.81 33.4,11.81 | U$1.VCC 47.6,30.69 47.81,30.48 | v47.24,36.32 47.82,35.74 47.82,30.49 47.81,30.48
  Bottom 0.152: S4.4 S4.3 | S3.4 S3.3 | S2.4 S2.3 | S5.4 S5.3 | S1.4 S1.3 | v17.53,25.53 v17.53,24.31 | v21.64,40.26 22.62,40.26 23.3,39.57 24.42,39.57 24.7,39.29 24.7,38.18 v25.41,37.47 | v33.48,33.22 30.93,30.67 30.93,30.55 30.62,30.23 v30.62,30.11 | v33.2,30.28 33.47,30.28 v34.1,29.64 | v21.14,50.8 v22.1,50.8 | v27.04,50.8 v27.94,50.8 | v30.1,50.8 v31.05,50.8 | v46.28,36.32 v47.24,36.32
VF_PIN  (via drill 0.2)
  Top 0.152: C2.1 R9.1 18.22,43.81 20.96,43.81 20.96,40.31 v21.64,39.62 | v23.86,36.56 v23.87,36.55 23.87,34.55 24.26,34.16 24.83,34.16 v24.83,34.23 | v25.85,33.72 25.89,33.76 IC1.40
  Bottom 0.152: v21.64,39.62 21.82,39.44 22.38,39.44 23.86,37.96 v23.86,36.56 | v24.83,34.23 25.33,34.23 v25.85,33.72
VF_PIN1
  Top 0.152: CON1.1 15.29,42.78 R9.2
VSS  (via drill 0.2)
  Top 0.152: IC1.23 38.77,34.76 v38.86,34.67 | IC1.35 31.15,37.5 v31.5,37.85 | IC1.47 28.3,30.26 v28.27,30.23 | IC1.8 34.15,27.29 v34.04,27.18 | 25.91,22.35 26.1,22.55 C19.1 C18.1 | C12.1 35.43,17.91 | C13.1 37.59,17.91 | IC2.7 v18.8,25.53 | T1.2 26.59,44.91 v26.67,44.83 | C11.2 29.08,44.2 v29.34,44.45 | R24.1 24.64,40.26 v25,39.89 | C15.1 27.24,37.97 v26.42,37.97 | R15.2 v19.56,37.21 | 39.75,26.16 39.75,26.66 39.66,26.75 39.66,28.42 C16.1 | 44.07,29.09 U$1.LED_GND1 U$1.LED_GND2 | 44.07,26.67 U$1.LED_GND4 U$1.LED_GND3 | U$1.LED_GND2 44.08,28.33 44.07,28.32 | U$1.LED_GND3 44.17,27.53 44.07,27.43 | C14.1 24.51,29.72 v24,29.21 | R8.2 v13.97,36.32 | C5.2 v13.97,34.16 | U$1.LED_GND2 U$1.LED_GND3 | U$1.LED_GND3 46.54,27.49 v46.61,27.56 | U$1.GND1 v41.54,37.09 v41.53,37.08 | U$1.GND2 v47.37,31.49 v47.37,31.5
  Top 0.508: 39.37,26.54 39.75,26.16 40.39,25.53 v40.39,24.89 40.39,19.3 38.99,17.91 37.59,17.91 35.43,17.91 27.3,17.91 25.91,19.3 25.91,22.35 25.91,26.8 26.67,27.56 v29.59,27.56 29.84,27.56
  Bottom 0.152: v29.59,27.56 v29.59,29.21 | v34.04,27.18 34.04,28.96 33.4,29.59 v33.02,29.59
  pour Top: -4.7,69.34 -4.7,4.57 11.81,-11.94 56.26,-11.94 65.15,-3.05 65.15,64.26 60.07,69.34
  pour Bottom: -11.05,71.88 -11.05,-3.05 2.92,-17.02 65.15,-17.02 79.12,-3.05 79.12,62.99 70.23,71.88